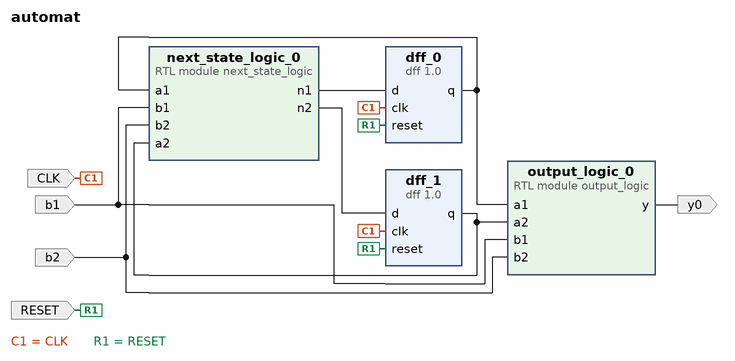
[diagram p0: block diagram of the top level]
# Vivado block design automat, xc7a35tcpg236-1, Vivado 2018.3
create_bd_design automat

create_bd_port -dir I b1
create_bd_port -dir I b2
create_bd_port -dir I CLK
create_bd_port -dir I RESET
create_bd_port -dir O y0

create_bd_cell -type module -reference next_state_logic next_state_logic_0
create_bd_cell -type ip -vlnv FIT:user:dff:1.0 dff_0
create_bd_cell -type ip -vlnv FIT:user:dff:1.0 dff_1
create_bd_cell -type module -reference output_logic output_logic_0

# ---- connections ----

connect_bd_net [get_bd_pins next_state_logic_0/n1] [get_bd_pins dff_0/d]
connect_bd_net [get_bd_pins next_state_logic_0/n2] [get_bd_pins dff_1/d]
connect_bd_net [get_bd_ports CLK] [get_bd_pins dff_1/clk] [get_bd_pins dff_0/clk]
connect_bd_net [get_bd_ports RESET] [get_bd_pins dff_1/reset] [get_bd_pins dff_0/reset]
connect_bd_net [get_bd_pins dff_0/q] [get_bd_pins output_logic_0/a1] [get_bd_pins next_state_logic_0/a1]
connect_bd_net [get_bd_pins dff_1/q] [get_bd_pins output_logic_0/a2] [get_bd_pins next_state_logic_0/a2]
connect_bd_net -net b1_1 [get_bd_ports b1] [get_bd_pins output_logic_0/b1] [get_bd_pins next_state_logic_0/b1]
connect_bd_net -net b2_1 [get_bd_ports b2] [get_bd_pins output_logic_0/b2] [get_bd_pins next_state_logic_0/b2]
connect_bd_net [get_bd_pins output_logic_0/y] [get_bd_ports y0]

validate_bd_design
save_bd_design
